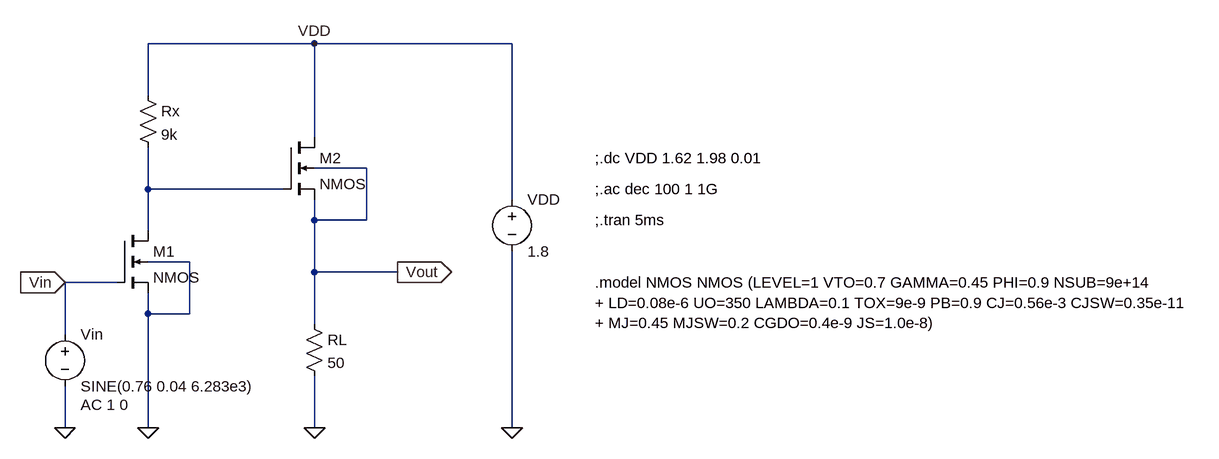
[diagram p0: schematic HW2_4109061012.asc]
HW2_4109061012.asc, the LTspice schematic file:
Version 4
SHEET 1 1840 944
WIRE 368 16 112 16
WIRE 672 16 368 16
WIRE 112 96 112 16
WIRE 368 160 368 16
WIRE 448 208 368 208
WIRE 112 240 112 176
WIRE 320 240 112 240
WIRE 672 256 672 16
WIRE 368 288 368 256
WIRE 448 288 448 208
WIRE 448 288 368 288
WIRE 112 304 112 240
WIRE 176 352 112 352
WIRE 368 368 368 288
WIRE 496 368 368 368
WIRE 64 384 -16 384
WIRE 112 432 112 400
WIRE 176 432 176 352
WIRE 176 432 112 432
WIRE 368 448 368 368
WIRE -16 464 -16 384
WIRE -16 608 -16 544
WIRE 112 608 112 432
WIRE 368 608 368 528
WIRE 672 608 672 336
FLAG 496 368 Vout
IOPIN 496 368 Out
FLAG 368 608 0
FLAG 112 608 0
FLAG -16 384 Vin
IOPIN -16 384 In
FLAG 672 608 0
FLAG -16 608 0
FLAG 368 16 VDD
DATAFLAG 448 368 ""
DATAFLAG 16 384 ""
SYMBOL res 96 80 R0
SYMATTR InstName Rx
SYMATTR Value 9k
SYMBOL nmos4 64 304 R0
SYMATTR InstName M1
SYMATTR Value2 l=0.5u w=61u
SYMBOL nmos4 320 160 R0
SYMATTR InstName M2
SYMATTR Value2 l=0.5u w=1949u
SYMBOL res 352 432 R0
SYMATTR InstName RL
SYMATTR Value 50
SYMBOL voltage 672 240 R0
WINDOW 123 0 0 Left 0
WINDOW 39 0 0 Left 0
SYMATTR InstName VDD
SYMATTR Value 1.8
SYMBOL voltage -16 448 R0
WINDOW 123 24 124 Left 2
WINDOW 39 0 0 Left 0
SYMATTR Value2 AC 1 0
SYMATTR InstName Vin
SYMATTR Value SINE(0.76 0.04 6.283e3)
TEXT 800 384 Left 2 !.model NMOS NMOS (LEVEL=1 VTO=0.7 GAMMA=0.45 PHI=0.9 NSUB=9e+14 \n+ LD=0.08e-6 UO=350 LAMBDA=0.1 TOX=9e-9 PB=0.9 CJ=0.56e-3 CJSW=0.35e-11 \n+ MJ=0.45 MJSW=0.2 CGDO=0.4e-9 JS=1.0e-8)
TEXT 800 192 Left 2 !;.dc VDD 1.62 1.98 0.01
TEXT 800 240 Left 2 !;.ac dec 100 1 1G
TEXT 800 288 Left 2 !;.tran 5ms

The netlist it stands for:
* HW2_4109061012.asc
Rx VDD N001 9k
M1 N001 Vin 0 0 NMOS l=0.5u w=61u
M2 VDD N001 Vout Vout NMOS l=0.5u w=1949u
RL Vout 0 50
VDD VDD 0 1.8
Vin Vin 0 SINE(0.76 0.04 6.283e3) AC 1 0
.model NMOS NMOS
.model PMOS PMOS
.lib standard.mos
.model NMOS NMOS (LEVEL=1 VTO=0.7 GAMMA=0.45 PHI=0.9 NSUB=9e+14
+ LD=0.08e-6 UO=350 LAMBDA=0.1 TOX=9e-9 PB=0.9 CJ=0.56e-3 CJSW=0.35e-11
+ MJ=0.45 MJSW=0.2 CGDO=0.4e-9 JS=1.0e-8)
;.dc VDD 1.62 1.98 0.01
;.ac dec 100 1 1G
;.tran 5ms
.backanno
.end